# Altium schematic sheet USB_to_UART.SchDoc
size A4
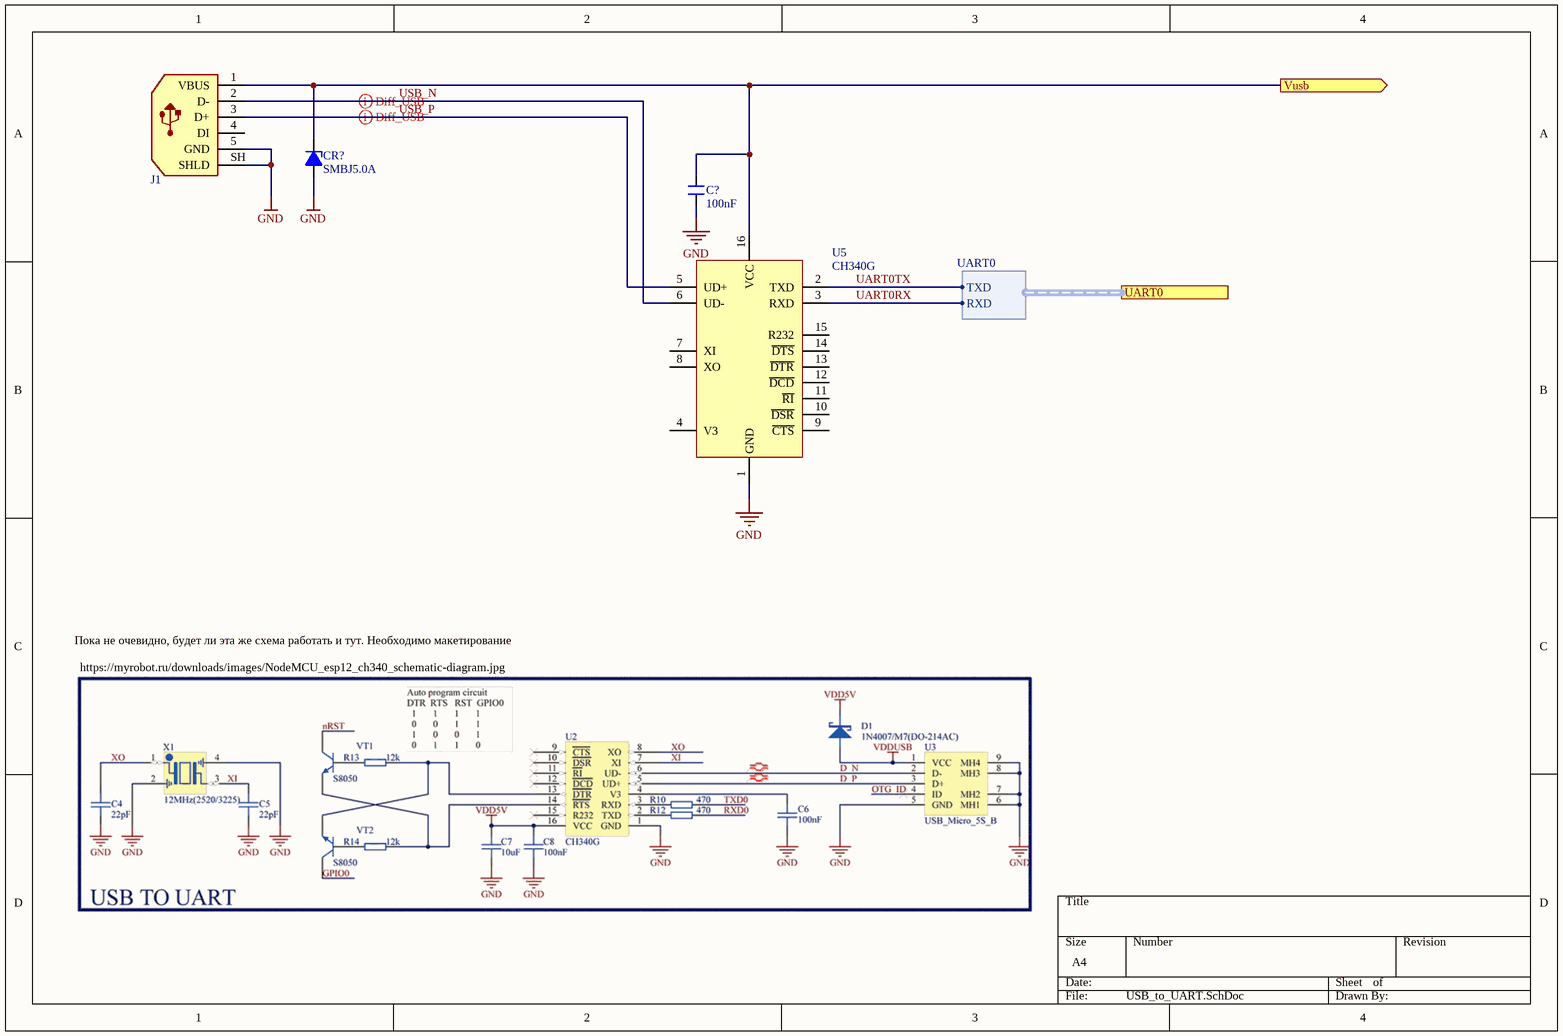
[diagram p0: USB_to_UART.SchDoc]

## Parts
C?  100nF  [CAP0603]
CR?  SMBJ5.0A  [DO-214AA-2_SMB]
J1  mini-USB female  [L-KLS1-229-5FC]  (value not drawn)
U5  CH340G  [SOIC-16]

## Ports
UART0 (harness UART0), Vusb (out)

## Harnesses
UART0: TXD, RXD

## Nets
GND: C?.1 CR?.2(A) J1.5(GND) J1.SH(SHLD) U5.1(GND)
UART0RX: U5.3(RXD) ; port UART0.RXD
UART0TX: U5.2(TXD) ; port UART0.TXD
USB_N: J1.2(D-) U5.6(UD-)
USB_P: J1.3(D+) U5.5(UD+)
Vusb: C?.2 CR?.1(C) J1.1(VBUS) U5.16(VCC) ; port Vusb

Not connected (* = marked no-connect by the designer): J1 4(DI); U5 4(V3) 7(XI) 8(XO) 9(~{CTS}) 10(~{DSR}) 11(~{RI}) 12(~{DCD}) 13(~{DTR}) 14(~{DTS}) 15(R232)

## Layout directives
differential pair; differential pair class USB; net class Diff_USB: USB_N, USB_P

## Notes on the sheet
- Пока не очевидно, будет ли эта же схема работать и тут. Необходимо макетирование
- https://myrobot.ru/downloads/images/NodeMCU_esp12_ch340_schematic-diagram.jpg

## Library data of the parts
C? = GCM188R71H104KA57J: Tolerance ±10% / Rated Voltage 50Vdc / Temperature 0±30ppm/℃; Manufacturer: Arrow Electronics; Item: 100nF 50V  ±10%; Vdc: 50V; Part Number: GCM188R71H104KA57J; Supplier 1: Mouser; Supplier Part Number 1: 81-GCM188R71H104KA7J; Case: 0603; Tolerance: 10%; Value: 100nF; HelpURL: http://www.farnell.com/datasheets/4360.pdf?src-supplier=Element14; Category: Multilayer Ceramic Capacitors - SMD/SMT
CR? = SMBJ5.0A: ESD Suppressors / TVS Diodes 600W 5V Unidirect; Manufacturer: Bourns; Part Number: SMBJ5.0A; Item: SMBJ5.0A; Supplier 1: Mouser; Vdss: 5V; Case: DO-214AA-2; HelpURL: https://eu.mouser.com/datasheet/2/54/smbj-778392.pdf; Category: ESD Suppressors / TVS Diodes
J1 = L-KLS1-229-5FC: USB Connectors MINI USB B; Manufacturer: KLS; Item: USB Mini B; Part Number: L-KLS1-229-5FC; Supplier 1: Belcip; Supplier Part Number 1: 07959; Case: Female; HelpURL: https://belchip.by/sitedocs/00007959.pdf; Category: USB Connectors
U5 = CH340G: USB to UART Converter; Manufacturer: Nanjing Qinheng Microelectronics Co., Ltd.; Part Number: CH340G; Item: CH340G; Supplier 1: ChipDip; Supplier Part Number 1: 9000890746; Case: SO16; HelpURL: https://static.chipdip.ru/lib/375/DOC030375417.pdf; Category: USB to UART Interface IC